# EAGLE schematic Processor_test (EAGLE 6.3)
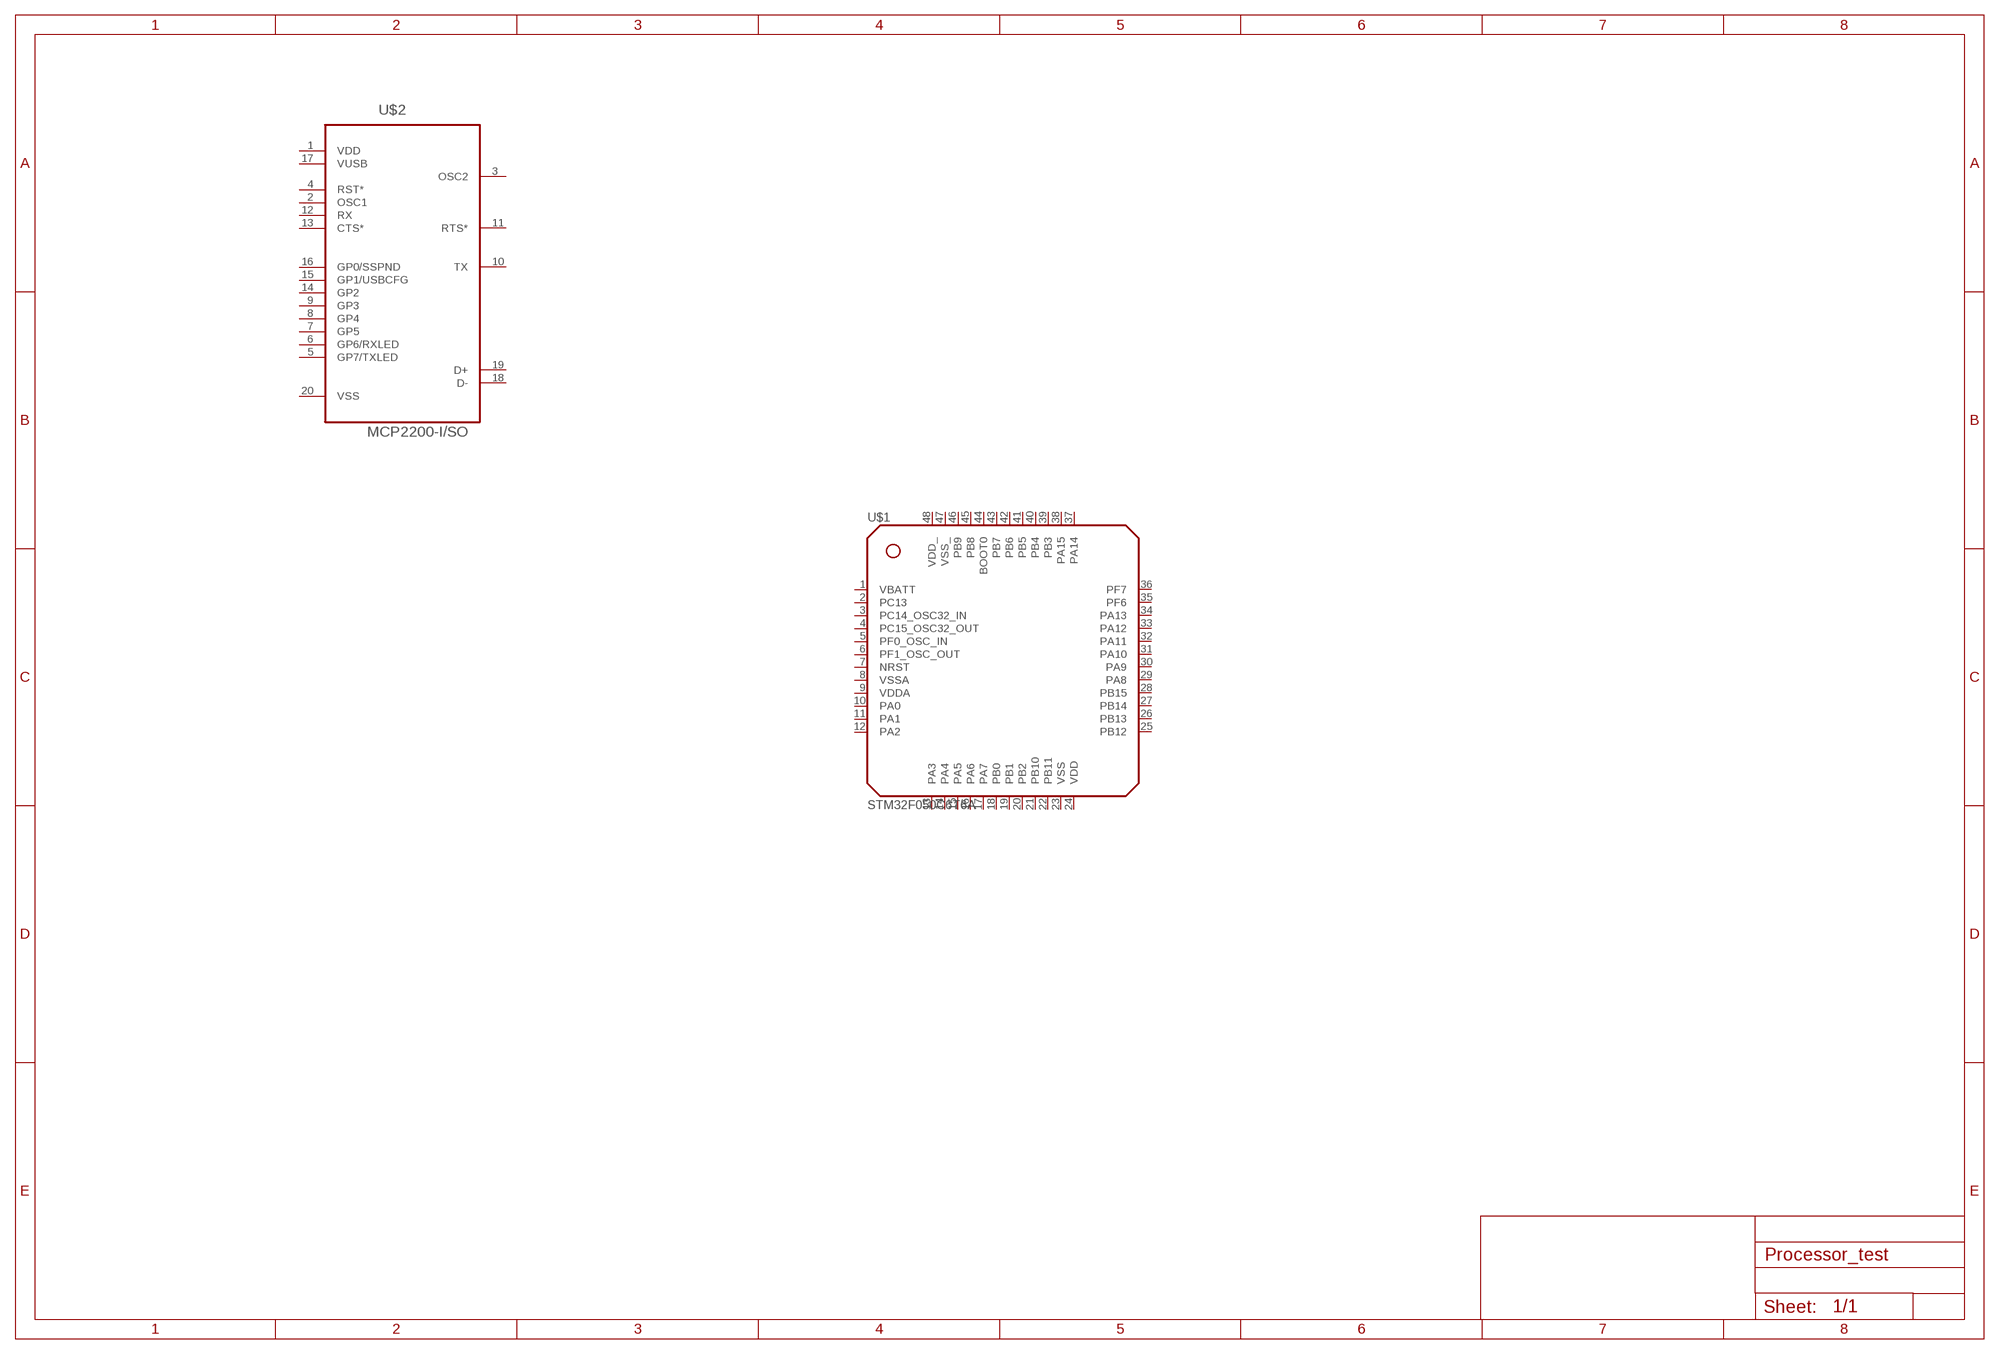
[diagram p0: schematic, sheet 1]

## Parts
U$1  STM32F050C6T6A  [LQFP48]
U$2  MCP2200-I/SO  [SOIC127P1034X264-20N]
Unconnected: U$1.1(VBATT) U$1.2(PC13) U$1.3(PC14_OSC32_IN) U$1.4(PC15_OSC32_OUT) U$1.5(PF0_OSC_IN) U$1.6(PF1_OSC_OUT) U$1.7(NRST) U$1.8(VSSA) U$1.9(VDDA) U$1.10(PA0) U$1.11(PA1) U$1.12(PA2) U$1.13(PA3) U$1.14(PA4) U$1.15(PA5) U$1.16(PA6) U$1.17(PA7) U$1.18(PB0) U$1.19(PB1) U$1.20(PB2) U$1.21(PB10) U$1.22(PB11) U$1.25(PB12) U$1.26(PB13) U$1.27(PB14) U$1.28(PB15) U$1.29(PA8) U$1.30(PA9) U$1.31(PA10) U$1.32(PA11) U$1.33(PA12) U$1.34(PA13) U$1.35(PF6) U$1.36(PF7) U$1.37(PA14) U$1.38(PA15) U$1.39(PB3) U$1.40(PB4) U$1.41(PB5) U$1.42(PB6) U$1.43(PB7) U$1.44(BOOT0) U$1.45(PB8) U$1.46(PB9) U$2.2(OSC1) U$2.3(OSC2) U$2.4(RST*) U$2.5(GP7/TXLED) U$2.6(GP6/RXLED) U$2.7(GP5) U$2.8(GP4) U$2.9(GP3) U$2.10(TX) U$2.11(RTS*) U$2.12(RX) U$2.13(CTS*) U$2.14(GP2) U$2.15(GP1/USBCFG) U$2.16(GP0/SSPND) U$2.18(D-) U$2.19(D+)

## Power pins joined to a net without a drawn wire
VDD: U$1.24(VDD) U$2.1(VDD)
VDD_: U$1.48(VDD_)
VSS: U$1.23(VSS) U$2.20(VSS)
VSS_: U$1.47(VSS_)
VUSB: U$2.17(VUSB)

## Library data of the parts
U$1 = equinox:STM32F050C6T6A
U$2 = equinox:MCP2200-I/SO: USB 2.0 to UART Protocol Converter with GPIO,20SOIC; MPN: MCP2200-I/SO; OC_FARNELL: 1781148; OC_NEWARK: 52R9947; PACKAGE: SOIC-20; SUPPLIER: Microchip